# EAGLE design tricorder-front-sensors-mk-1.0 (EAGLE 7.5.0)
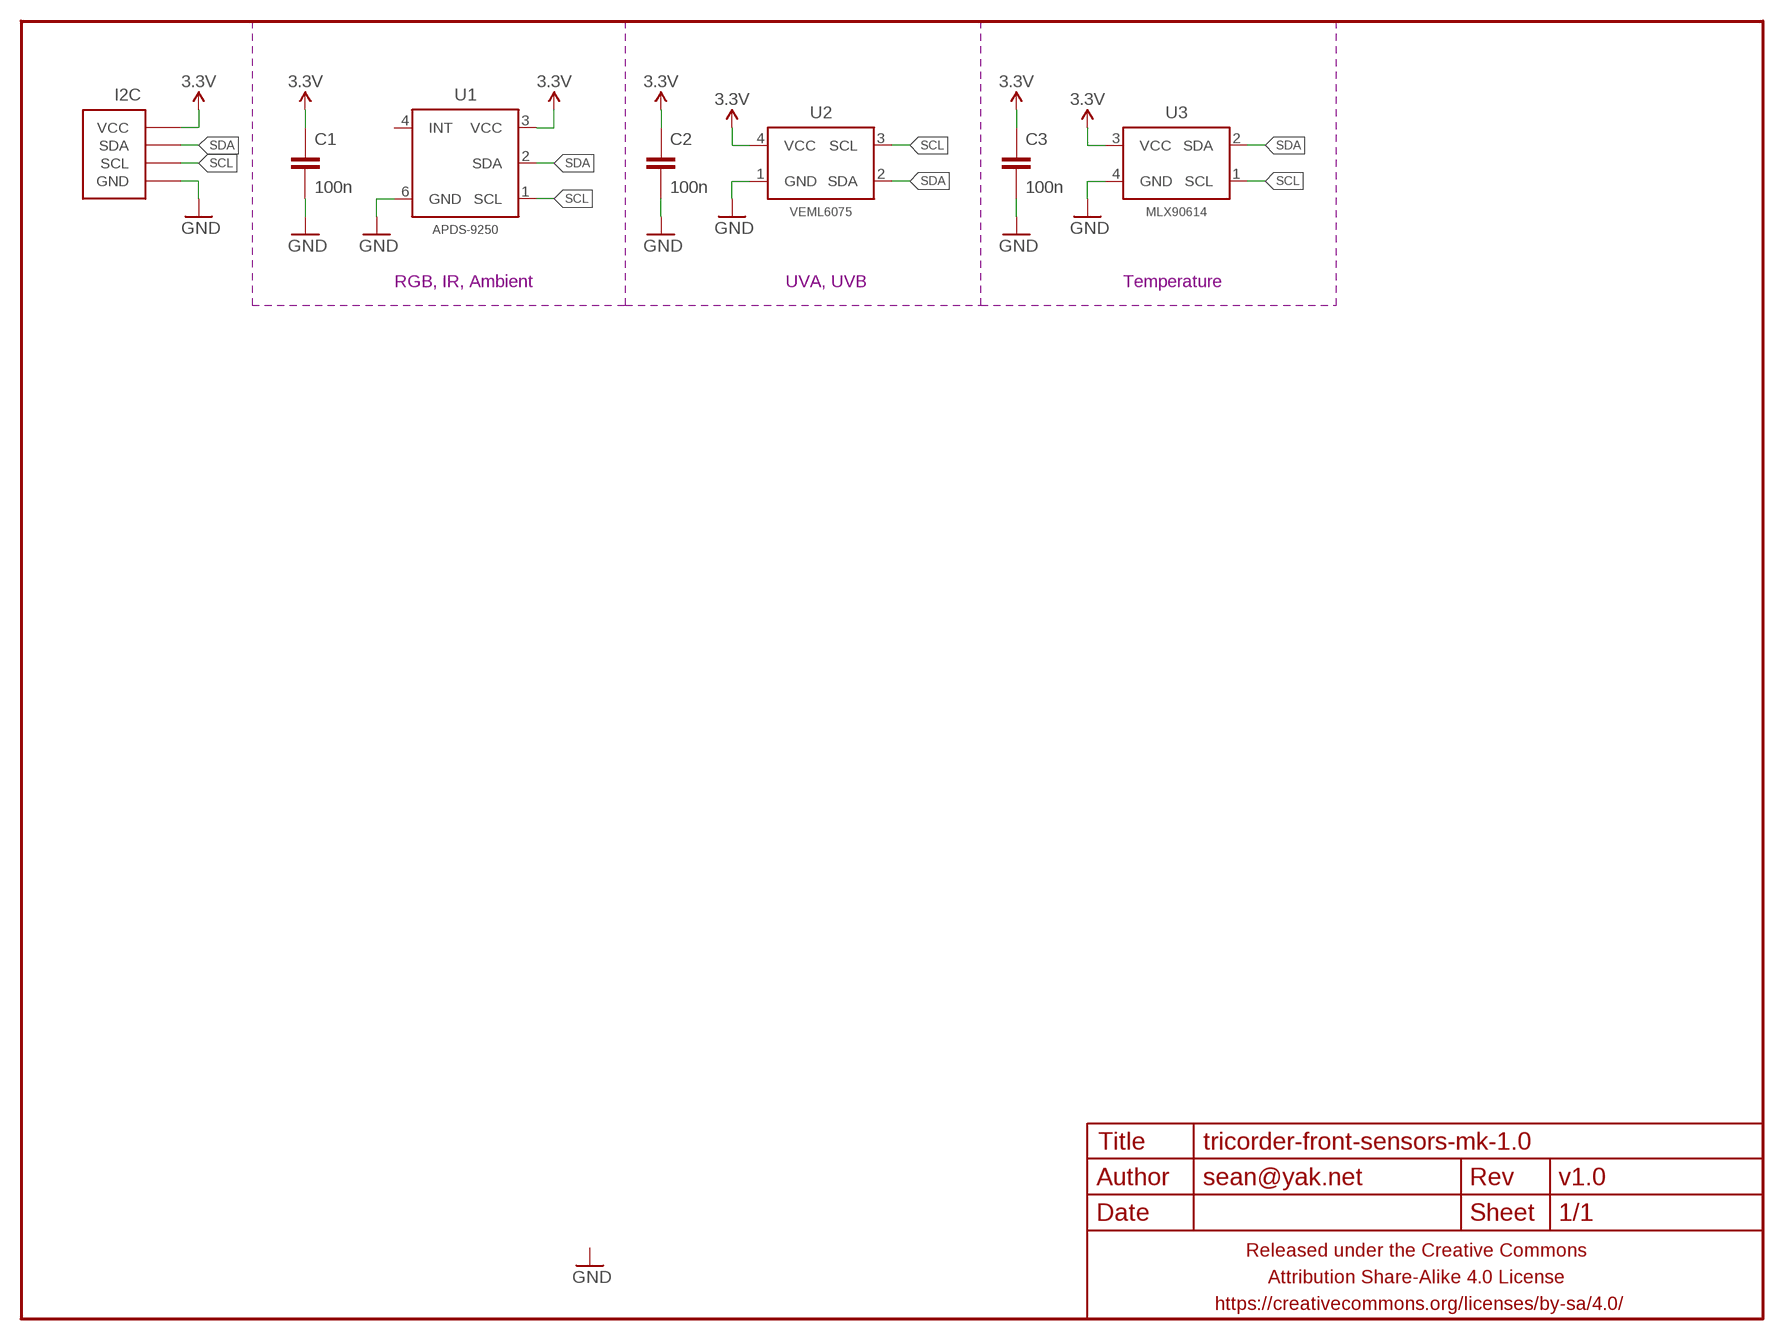
[diagram p0: schematic, sheet 1]

## Parts
C1  100n  CAPACITOR-CERAMICC0603  [C0603]
C2  100n  CAPACITOR-CERAMICC0603  [C0603]
C3  100n  CAPACITOR-CERAMICC0603  [C0603]
FRAME1  FRAME-LETTERNO_PACKAGE  [DUMMY]
I2C  M04-I2CJST-4-PH-VERT-CENTERED-I2C  [JST-4-PH-VERT-PTH-CENTERED-I2C]
U1  APDS-9250  [APDS-9250]
U2  VEML6075  [OPLGA4]
U3  MLX90614  [TO-39-4]

## Nets
3.3V: C1.1 C2.1 C3.1 I2C.2(VCC) U1.3(VCC) U2.4(VCC) U3.3(VCC)
GND: C1.2 C2.2 C3.2 I2C.1(GND) U1.6(GND) U2.1(GND) U3.4(GND)
SCL: I2C.4(SCL) U1.1(SCL) U2.3(SCL) U3.1(SCL)
SDA: I2C.3(SDA) U1.2(SDA) U2.2(SDA) U3.2(SDA)
Unconnected: U1.4(INT)

## Notes on the sheet
- RGB, IR, Ambient | UVA, UVB | Temperature

## Library data of the parts
C1-C3 = a_parts:CAPACITOR-CERAMIC: CAPACITOR, European symbol
FRAME1 = a_parts:FRAME-LETTER: Schematic Frame Standard 8.5x11 US Letter frame; DESIGNER: sean@yak.net; VERSION: v1.0
I2C = a_parts:M04-I2C
U1 = a_parts:APDS-9250
U2 = a_parts:VEML6075
U3 = a_parts:MLX90614

## Board
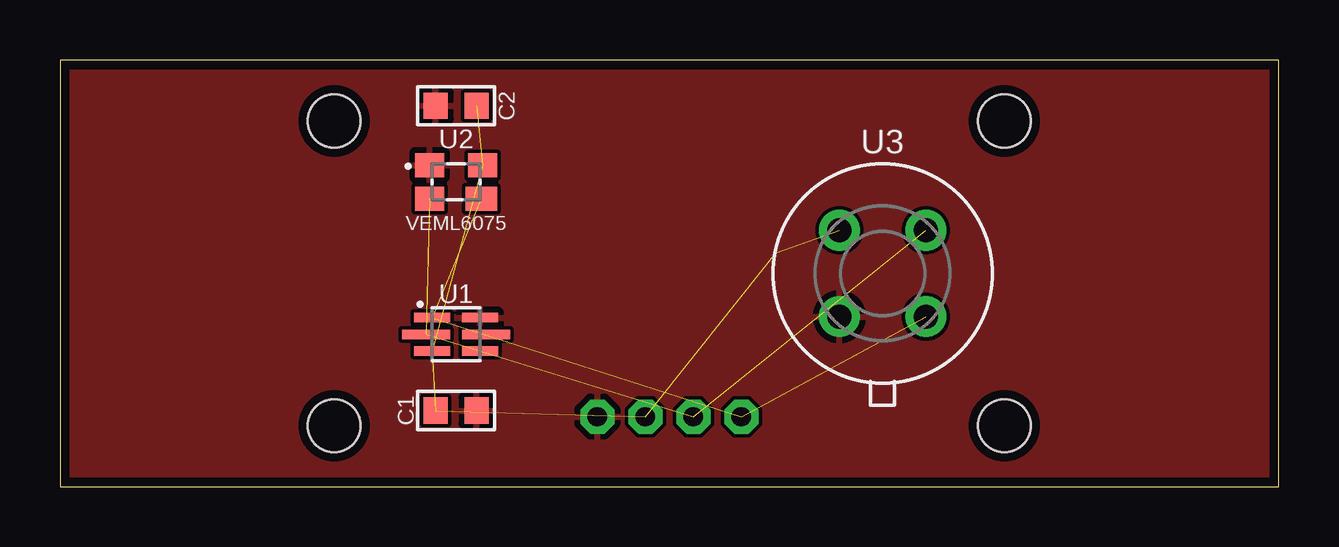
[diagram p1: board, top side]
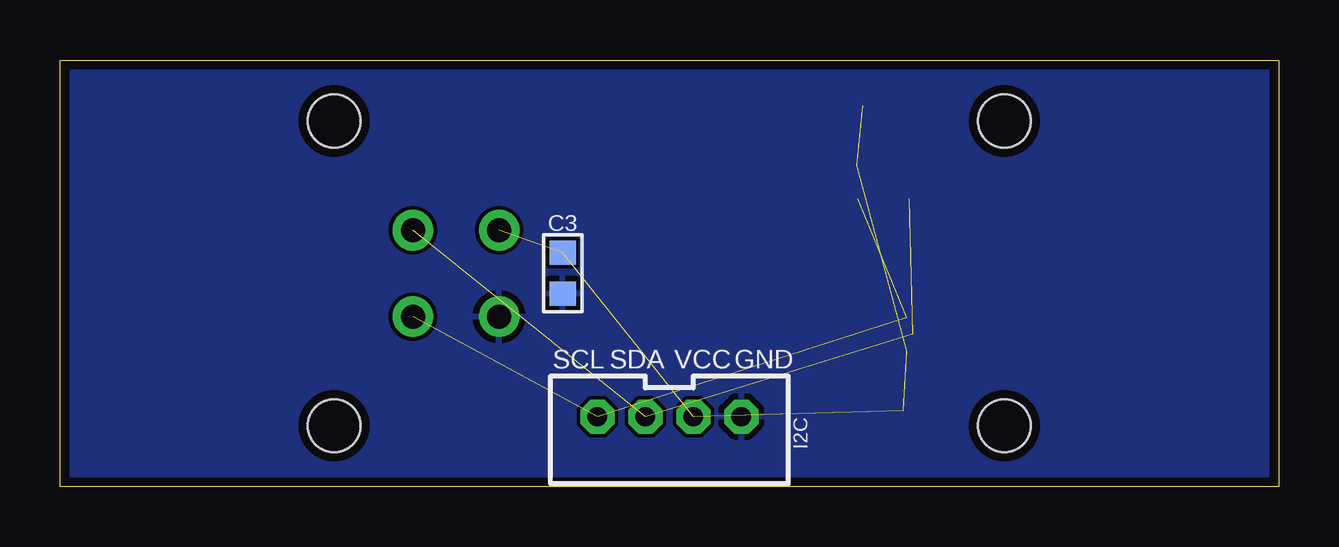
[diagram p2: board, bottom side, seen from below]

Size 50.8 x 17.78 mm. Coordinates in mm from the lower left corner, seen from the top.
Outline: 0,0 50.8,0 50.8,17.78 0,17.78 0,0
Copper layers (1*16): Top 0.0356mm / dielectric 1.5011mm / Bottom 0.0356mm
Design rules "LaenPCBOrder2": minimum track width 6mil, minimum drill 13mil, track to track 6mil, track to pad 6mil, pad to pad 6mil, via to via 6mil, smd to smd 6mil, copper to edge 15mil, drill to drill 6mil, minimum pad ring 7mil, minimum via ring 7mil, stop-mask expansion 3mil, vias tented up to drill 20mil, thermal gap 10mil
Holes 2.2 mm at 11.43,15.24 11.43,2.54 39.37,15.24 39.37,2.54

### Footprints (pad centres in the part's own frame; a part is rotated, then mirrored left to right if it is on the bottom)
C0603 = smd 1 x 1.1: 1 -0.85,0; 2 0.85,0
JST-4-PH-VERT-PTH-CENTERED-I2C = drill 0.8 pad 1.422 octagon: 1 -3,0; 2 -1,0; 3 1,0; 4 3,0
APDS-9250 = smd 1.5 x 0.4: 1 -1,0.7; 3 -1,-0.7; 4 1,-0.7; 6 1,0.7 | smd 2 x 0.4: 2 -1.25,0; 5 1.25,0
OPLGA4 = smd 1.2 x 1: 1 -1.1,0.7; 2 -1.1,-0.7; 4 1.1,0.7 | smd 1.3 x 1: 3 1.05,-0.7
TO-39-4 = drill 1 pad 1.7: 1 -1.8,1.8; 2 -1.8,-1.8; 3 1.8,-1.8; 4 1.8,1.8

### Placement (x,y rotation side)
C1  16.51,3.17 0 top
C2  16.51,15.88 180 top
C3  29.84,8.89 270 bottom
FRAME1  0,0 0 top
I2C  25.4,2.92 180 bottom
U1  16.51,6.35 0 top
U2  16.51,12.7 0 top
U3  34.29,8.89 180 top

### Tracks (layer width: path | path; a pad name or v marks a point on that pad's centre or on a via)
3.3V  (6 unrouted)
GND
  pour Bottom: 0,0 50.8,0 50.8,17.78 0,17.78
  pour Top: 0,0 50.8,0 50.8,17.78 0,17.78
SCL  (3 unrouted)
SDA  (3 unrouted)